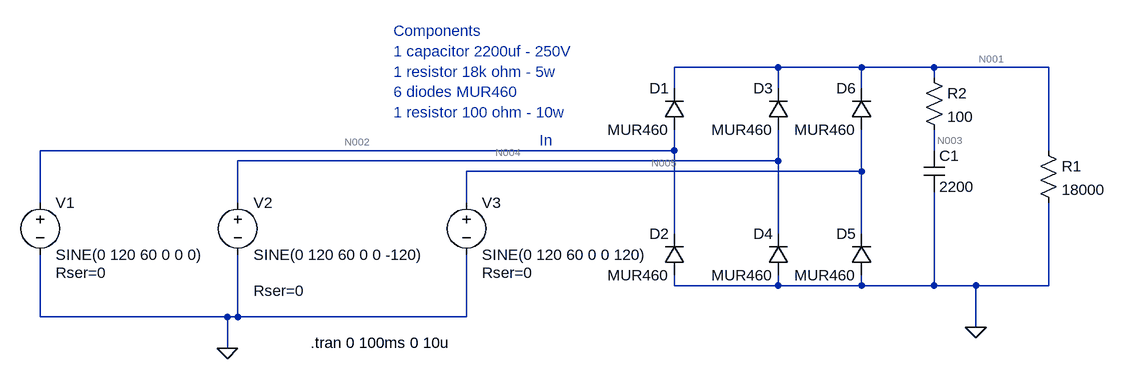
[diagram p0: schematic No load.asc]
No load.asc, the LTspice schematic file:
Version 4.1
SHEET 1 1708 680
WIRE 720 -48 560 -48
WIRE 848 -48 720 -48
WIRE 960 -48 848 -48
WIRE 1136 -48 960 -48
WIRE 960 -32 960 -48
WIRE 560 -16 560 -48
WIRE 720 -16 720 -48
WIRE 848 -16 848 -48
WIRE 560 80 560 48
WIRE 560 80 -416 80
WIRE 960 80 960 48
WIRE 1136 80 1136 -48
WIRE 720 96 720 48
WIRE 720 96 -112 96
WIRE 848 112 848 48
WIRE 848 112 240 112
WIRE -416 160 -416 80
WIRE -112 160 -112 96
WIRE 240 160 240 112
WIRE 560 208 560 80
WIRE 720 208 720 96
WIRE 848 208 848 112
WIRE 560 288 560 272
WIRE 720 288 720 272
WIRE 720 288 560 288
WIRE 848 288 848 272
WIRE 848 288 720 288
WIRE 960 288 960 144
WIRE 960 288 848 288
WIRE 1024 288 960 288
WIRE 1136 288 1136 160
WIRE 1136 288 1024 288
WIRE -416 336 -416 240
WIRE -128 336 -416 336
WIRE -112 336 -112 240
WIRE -112 336 -128 336
WIRE 240 336 240 240
WIRE 240 336 -112 336
WIRE 1024 352 1024 288
WIRE -128 384 -128 336
FLAG -128 384 0
FLAG 1024 352 0
SYMBOL voltage -416 144 R0
WINDOW 123 0 0 Left 0
WINDOW 39 24 124 Left 2
SYMATTR SpiceLine Rser=0
SYMATTR InstName V1
SYMATTR Value SINE(0 120 60 0 0 0)
SYMBOL voltage -112 144 R0
WINDOW 123 24 124 Left 2
WINDOW 39 24 152 Left 2
SYMATTR SpiceLine Rser=0
SYMATTR InstName V2
SYMATTR Value SINE(0 120 60 0 0 -120)
SYMBOL voltage 240 144 R0
WINDOW 123 0 0 Left 0
WINDOW 39 24 124 Left 2
SYMATTR SpiceLine Rser=0
SYMATTR InstName V3
SYMATTR Value SINE(0 120 60 0 0 120)
SYMBOL diode 576 48 R180
WINDOW 0 24 64 Left 2
WINDOW 3 24 0 Left 2
SYMATTR InstName D1
SYMATTR Value MUR460
SYMBOL diode 576 272 R180
WINDOW 0 24 64 Left 2
WINDOW 3 24 0 Left 2
SYMATTR InstName D2
SYMATTR Value MUR460
SYMBOL diode 736 48 R180
WINDOW 0 24 64 Left 2
WINDOW 3 24 0 Left 2
SYMATTR InstName D3
SYMATTR Value MUR460
SYMBOL diode 736 272 R180
WINDOW 0 24 64 Left 2
WINDOW 3 24 0 Left 2
SYMATTR InstName D4
SYMATTR Value MUR460
SYMBOL diode 864 272 R180
WINDOW 0 24 64 Left 2
WINDOW 3 24 0 Left 2
SYMATTR InstName D5
SYMATTR Value MUR460
SYMBOL diode 864 48 R180
WINDOW 0 24 64 Left 2
WINDOW 3 24 0 Left 2
SYMATTR InstName D6
SYMATTR Value MUR460
SYMBOL cap 944 80 R0
SYMATTR InstName C1
SYMATTR Value 2200
SYMATTR SpiceLine V=250
SYMBOL res 1120 64 R0
SYMATTR InstName R1
SYMATTR Value 18000
SYMATTR SpiceLine tol=5 pwr=5
SYMBOL res 944 -48 R0
SYMATTR InstName R2
SYMATTR Value 100
SYMATTR SpiceLine tol=5 pwr=10
TEXT 0 376 Left 2 !.tran 0 100ms 0 10u
TEXT 352 64 Left 2 ;In
TEXT 128 -104 Left 2 ;Components\n1 capacitor 2200uf - 250V\n1 resistor 18k ohm - 5w\n6 diodes MUR460 \n1 resistor 100 ohm - 10w

The netlist it stands for:
* No load.asc
V1 N002 0 SINE(0 120 60 0 0 0) Rser=0
V2 N004 0 SINE(0 120 60 0 0 -120) Rser=0
V3 N005 0 SINE(0 120 60 0 0 120) Rser=0
D1 N002 N001 MUR460
D2 0 N002 MUR460
D3 N004 N001 MUR460
D4 0 N004 MUR460
D5 0 N005 MUR460
D6 N005 N001 MUR460
C1 N003 0 2200 V=250
R1 N001 0 18000 tol=5 pwr=5
R2 N001 N003 100 tol=5 pwr=10
.model D D
.lib standard.dio
.tran 0 100ms 0 10u
* In
* Components
* 1 capacitor 2200uf - 250V
* 1 resistor 18k ohm - 5w
* 6 diodes MUR460
* 1 resistor 100 ohm - 10w
.backanno
.end

* Results of the author's LTspice run, read from the files saved beside the schematic
* Operating Point, zero values left out:
*   V(n004) = -103.9 V
*   V(n001) = 103.4 V
*   V(n003) = 103.4 V
*   V(n005) = 103.9 V
*   I(V1) = 149.1 nA
*   I(D3) = -149.2 nA
*   I(V3) = -5.744 mA
*   I(D5) = -149.1 nA
*   I(R1) = 5.743 mA
*   I(D4) = 2.675 kA
*   I(R2) = 227.4 nA
*   I(V2) = 2.675 kA
*   I(D1) = -149.1 nA
*   I(D6) = 5.744 mA
*   I(C1) = 227.4 nA
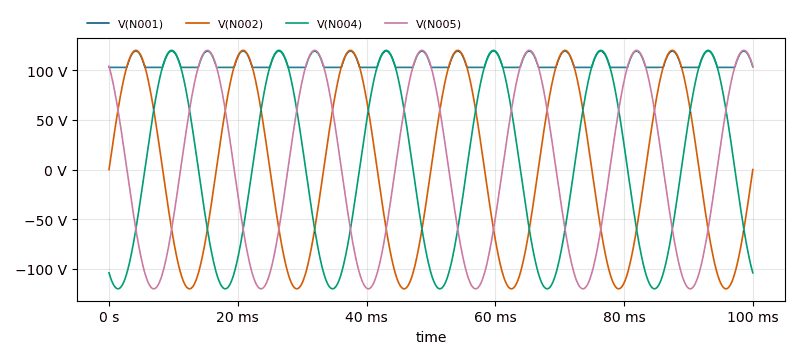
[diagram p1: Transient Analysis of No load.asc, plotted from the saved traces]
* Transient Analysis, 1 run:
*   V(N001): min 102.8 V, max 119.3 V, average 108.4 V, rms 108.5 V, last 103.4 V
*   V(N002): min -120 V, max 120 V, average 0 V, rms 84.85 V, last 0 V
*   V(N004): min -120 V, max 120 V, average 0 V, rms 84.85 V, last -103.9 V
*   V(N005): min -120 V, max 120 V, average 0 V, rms 84.85 V, last 103.9 V